# EAGLE design riaa_pre (EAGLE 6.2)
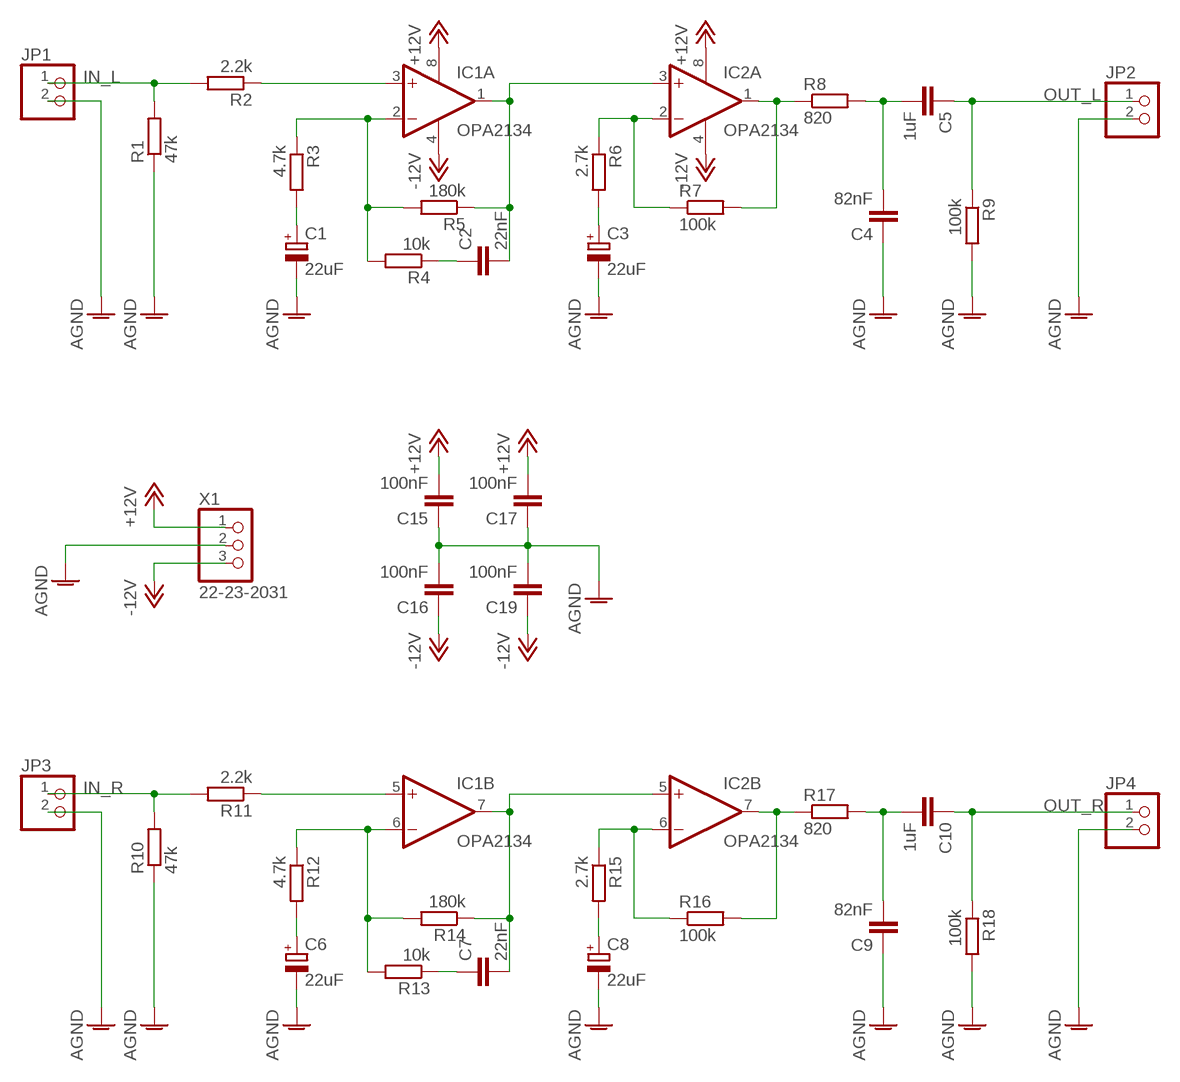
[diagram p0: schematic, sheet 1]

## Parts
C1  22uF  CPOL-EUE2.5-6  [E2,5-6]
C2  22nF  C-EU050-025X075  [C050-025X075]
C3  22uF  CPOL-EUE2.5-6  [E2,5-6]
C4  82nF  C-EU050-025X075  [C050-025X075]
C5  1uF  C-EU050-045X075  [C050-045X075]
C6  22uF  CPOL-EUE2.5-6  [E2,5-6]
C7  22nF  C-EU050-025X075  [C050-025X075]
C8  22uF  CPOL-EUE2.5-6  [E2,5-6]
C9  82nF  C-EU050-025X075  [C050-025X075]
C10  1uF  C-EU050-045X075  [C050-045X075]
C15  100nF  C-EU050-025X075  [C050-025X075]
C16  100nF  C-EU050-025X075  [C050-025X075]
C17  100nF  C-EU050-025X075  [C050-025X075]
C19  100nF  C-EU050-025X075  [C050-025X075]
IC1  OPA2134  OPA2134PA  [DIL08]
IC2  OPA2134  OPA2134PA  [DIL08]
JP1  PINHD-1X2  [1X02]
JP2  PINHD-1X2  [1X02]
JP3  PINHD-1X2  [1X02]
JP4  PINHD-1X2  [1X02]
R1  47k  R-EU_0207/7  [0207/7]
R2  2.2k  R-EU_0207/7  [0207/7]
R3  4.7k  R-EU_0207/7  [0207/7]
R4  10k  R-EU_0207/7  [0207/7]
R5  180k  R-EU_0207/7  [0207/7]
R6  2.7k  R-EU_0207/7  [0207/7]
R7  100k  R-EU_0207/7  [0207/7]
R8  820  R-EU_0207/7  [0207/7]
R9  100k  R-EU_0207/7  [0207/7]
R10  47k  R-EU_0207/7  [0207/7]
R11  2.2k  R-EU_0207/7  [0207/7]
R12  4.7k  R-EU_0207/7  [0207/7]
R13  10k  R-EU_0207/7  [0207/7]
R14  180k  R-EU_0207/7  [0207/7]
R15  2.7k  R-EU_0207/7  [0207/7]
R16  100k  R-EU_0207/7  [0207/7]
R17  820  R-EU_0207/7  [0207/7]
R18  100k  R-EU_0207/7  [0207/7]
X1  22-23-2031  [22-23-2031]

## Nets
+12V: C15.2 C17.2 IC1.8(A:V+) IC2.8(A:V+) X1.1
-12V: C16.1 C19.1 IC1.4(A:V-) IC2.4(A:V-) X1.3
AGND: C1.- C3.- C4.1 C6.- C8.- C9.1 C15.1 C16.2 C17.1 C19.2 JP1.2 JP2.2 JP3.2 JP4.2 R1.1 R9.2 R10.1 R18.2 X1.2
IN_L: JP1.1 R1.2 R2.2
IN_R: JP3.1 R10.2 R11.2
N$1: C3.+ R6.2
N$2: IC1.3(A:+IN) R2.1
N$3: C2.2 IC1.1(A:OUT) IC2.3(A:+IN) R5.1
N$4: C4.2 C5.2 R8.2
N$5: C2.1 R4.1
N$6: IC1.2(A:-IN) R3.1 R4.2 R5.2
N$8: IC2.6(B:-IN) R15.1 R16.1
N$9: IC2.7(B:OUT) R16.2 R17.1
N$10: IC1.5(B:+IN) R11.1
N$11: C7.2 IC1.7(B:OUT) IC2.5(B:+IN) R14.1
N$12: C7.1 R13.1
N$13: IC1.6(B:-IN) R12.1 R13.2 R14.2
N$14: C6.+ R12.2
N$15: C8.+ R15.2
N$16: C9.2 C10.2 R17.2
N$19: IC2.2(A:-IN) R6.1 R7.1
N$20: IC2.1(A:OUT) R7.2 R8.1
N$37: C1.+ R3.2
OUT_L: C5.1 JP2.1 R9.1
OUT_R: C10.1 JP4.1 R18.1

## Library data of the parts
C1 C3 C6 C8 = amp:CPOL-EU: POLARIZED CAPACITOR, European symbol
C2 C4 C5 C7 C9 C10 C15-C17 C19 = amp:C-EU: CAPACITOR, European symbol
IC1 IC2 = amp:OPA2*: Dual Operational Amplifier Low Power, Single-Supply, Rail-To-Rail Operational Amplifier Source: http://focus.ti.com/lit/ds/symlink/opa2345.pdf http://focus.ti.com .. opa241.pdf http://focus.ti.com/lit/ds/symlink/opa2134.pdf
JP1-JP4 = amp:PINHD-1X2: PIN HEADER
R1-R18 = amp:R-EU_: RESISTOR, European symbol
X1 = amp:22-23-2031: .100" (2.54mm) Center Header - 3 Pin

## Board
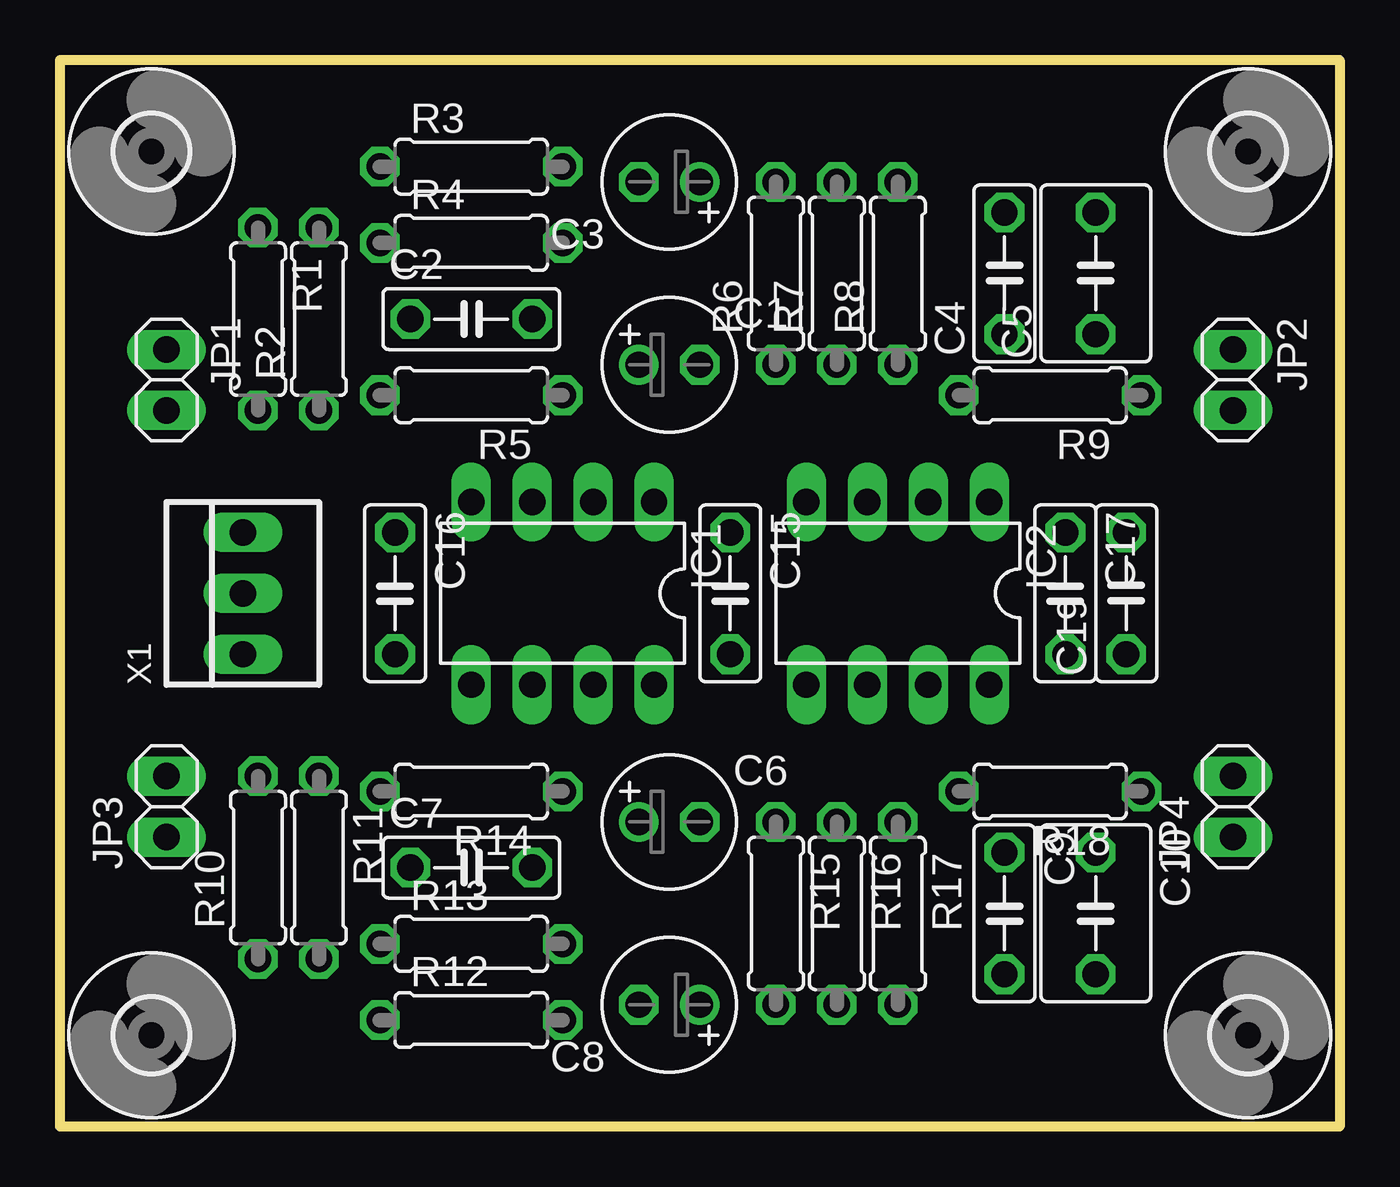
[diagram p1: board, top side]
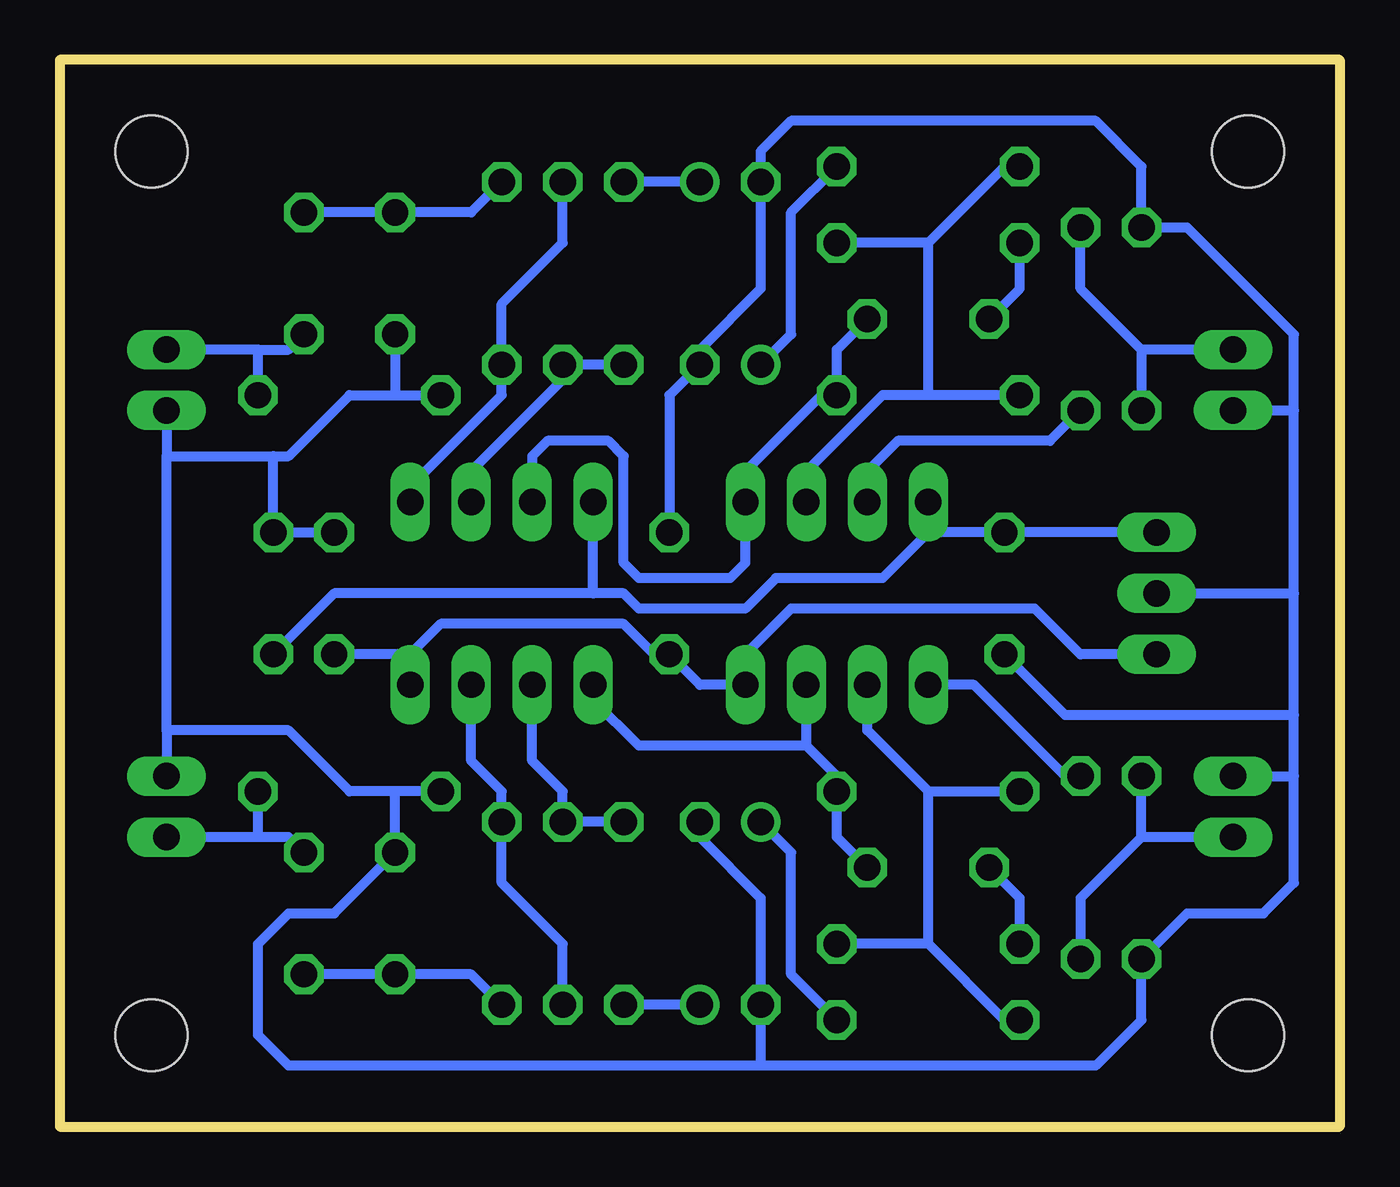
[diagram p2: board, bottom side, seen from below]

Size 53.34 x 44.45 mm. Coordinates in mm from the lower left corner, seen from the top.
Outline: 0.64,44.44 0,44.45
Outline: 0,44.45 0,0 53.34,0 53.34,44.45 0,44.45
Copper layers (1*16): Top 0.035mm / dielectric 1.5mm / Bottom 0.035mm
Design rules: minimum track width 10mil, minimum drill 24mil, track to track 8mil, track to pad 8mil, pad to pad 8mil, via to via 8mil, smd to smd 8mil, copper to edge 40mil, drill to drill 8mil, minimum pad ring 10mil, minimum via ring 8mil, stop-mask expansion 4mil, vias tented up to drill 0mil, thermal gap 10mil

### Footprints (pad centres in the part's own frame; a part is rotated, then mirrored left to right if it is on the bottom)
E2,5-6 = drill 1.1: + -1.27,0 | drill 1.1 pad 1.6 octagon: - 1.27,0
C050-025X075 = drill 1.1 octagon: 1 -2.54,0; 2 2.54,0
C050-045X075 = drill 1.1 octagon: 1 -2.54,0; 2 2.54,0
DIL08 = drill 1.1 long: 1 -3.81,-3.81; 2 -1.27,-3.81; 3 1.27,-3.81; 4 3.81,-3.81; 5 3.81,3.81; 6 1.27,3.81; 7 -1.27,3.81; 8 -3.81,3.81
1X02 = drill 1.1 long: 1 -1.27,0; 2 1.27,0
0207/7 = drill 1.1 octagon: 1 -3.81,0; 2 3.81,0
3,0 = hole 3: 0,0
22-23-2031 = drill 1.1 long: 1 -2.54,0; 2 0,0; 3 2.54,0

### Placement (x,y rotation side)
C1  25.4,31.75 0 top
C2  17.14,33.66 0 top
C3  25.4,39.37 180 top
C4  39.37,35.56 90 top
C5  43.18,35.56 90 top
C6  25.4,12.7 0 top
C7  17.14,10.79 0 top
C8  25.4,5.08 180 top
C9  39.37,8.89 270 top
C10  43.18,8.89 270 top
C15  27.94,22.23 270 top
C16  13.97,22.23 270 top
C17  41.91,22.23 270 top
C19  44.45,22.23 90 top
IC1  20.95,22.23 180 top
IC2  34.92,22.23 180 top
JP1  4.45,31.11 270 top
JP2  48.9,31.11 270 top
JP3  4.45,13.34 90 top
JP4  48.9,13.34 90 top
R1  8.26,33.66 270 top
R2  10.79,33.66 90 top
R3  17.14,40.01 0 top
R4  17.14,36.83 0 top
R5  17.14,30.48 180 top
R6  29.84,35.56 90 top
R7  32.38,35.56 90 top
R8  34.92,35.56 90 top
R9  41.27,30.48 180 top
R10  8.26,10.79 90 top
R11  10.79,10.79 270 top
R12  17.14,4.45 0 top
R13  17.14,7.62 0 top
R14  17.14,13.97 180 top
R15  29.84,8.89 270 top
R16  32.38,8.89 270 top
R17  34.92,8.89 270 top
R18  41.27,13.97 180 top
U$1  [3,0]  3.81,3.81 0 top
U$2  [3,0]  3.81,40.64 0 top
U$3  [3,0]  49.53,40.64 0 top
U$4  [3,0]  49.53,3.81 0 top
X1  7.62,22.23 90 top

### Tracks (layer width: path | path; a pad name or v marks a point on that pad's centre or on a via)
+12V
  Bottom 0.406: 38.73,19.68 37.47,20.95 29.84,20.95 28.57,19.68 C15.2 26.67,18.41 IC1.8 24.77,19.68 22.86,21.59 12.7,21.59 10.79,19.68 X1.1 | 38.73,19.68 IC2.8 | 38.73,19.68 C17.2
-12V
  Bottom 0.406: X1.3 C16.1 17.14,24.77 | 17.14,24.77 IC1.4 | C19.1 41.91,22.23 31.11,22.23 | 17.14,24.77 19.05,22.86 23.5,22.86 24.77,21.59 29.21,21.59 29.84,22.23 31.11,22.23 | 31.11,22.23 IC2.4
AGND
  Bottom 0.406: C17.1 C19.2 44.45,27.94 | C15.1 27.94,30.48 C1.- 26.67,32.38 24.13,34.92 C3.- 24.13,40.64 22.86,41.91 10.16,41.91 8.26,40.01 R1.1 6.35,37.47 1.91,33.02 1.91,29.84 | 1.91,22.23 1.91,29.84 | 1.91,17.14 1.91,22.23 | 1.91,14.61 1.91,10.16 3.17,8.89 6.35,8.89 R10.1 8.26,4.45 10.16,2.54 24.13,2.54 | 1.91,14.61 1.91,17.14 | 1.91,17.14 11.43,17.14 C16.2 | 24.13,2.54 43.81,2.54 45.09,3.81 45.09,7.62 43.81,8.89 41.91,8.89 C9.1 39.37,13.97 | 48.9,16.51 JP4.2 | 48.9,16.51 48.9,27.94 | 48.9,16.51 43.81,16.51 41.27,13.97 39.37,13.97 | 48.9,27.94 44.45,27.94 | 44.45,27.94 43.81,27.94 41.27,30.48 39.37,30.48 | X1.2 1.91,22.23 | JP1.2 1.91,29.84 | JP3.2 1.91,14.61 | JP2.2 48.9,27.94 | R18.2 39.37,13.97 | C6.- 26.67,12.06 24.13,9.53 C8.- 24.13,2.54 | 39.37,30.48 R9.2 | C4.1 39.37,30.48
IN_L
  Bottom 0.406: 8.26,32.38 R1.2 | 8.26,32.38 10.79,34.92 R2.2 | JP1.1 8.26,32.38
IN_R
  Bottom 0.406: 8.26,12.06 R10.2 | 8.26,12.06 10.79,9.53 R11.2 | JP3.1 8.26,12.06
N$1
  Bottom 0.406: C3.+ R6.2
N$2
  Bottom 0.406: R2.1 12.06,28.57 18.41,28.57 19.68,27.3 IC1.3
N$3
  Bottom 0.406: IC2.3 33.66,27.94 33.02,28.57 30.48,28.57 29.84,27.94 29.84,23.5 29.21,22.86 25.4,22.86 24.77,23.5 IC1.1 24.77,27.3 21.59,30.48 R5.1 20.95,32.38 C2.2
N$4
  Bottom 0.406: R8.2 36.2,38.1 C4.2 C5.2
N$5
  Bottom 0.406: R4.1 13.34,34.92 C2.1
N$6
  Bottom 0.406: R5.2 17.14,30.48 | 17.14,30.48 19.05,30.48 22.23,27.3 IC1.2 | R3.1 13.97,40.01 17.14,36.83 | 17.14,30.48 17.14,36.83 | 17.14,36.83 R4.2
N$8
  Bottom 0.406: R15.1 R16.1 32.38,13.97 33.66,15.24 IC2.6
N$9
  Bottom 0.406: IC2.7 36.2,15.24 34.92,13.97 R17.1 34.92,10.16 32.38,7.62 R16.2
N$10
  Bottom 0.406: R11.1 11.43,14.61 15.24,18.41 IC1.5
N$11
  Bottom 0.406: C7.2 20.95,12.06 R14.1 20.95,14.61 22.23,15.88 | 22.23,15.88 IC1.7 | IC2.5 31.11,17.78 29.21,15.88 22.23,15.88
N$12
  Bottom 0.406: R13.1 13.34,9.53 C7.1
N$13
  Bottom 0.406: R12.1 13.97,4.45 17.14,7.62 | 17.14,7.62 R13.2 | 17.14,7.62 17.14,13.97 | 17.14,13.97 19.68,16.51 IC1.6 | 17.14,13.97 R14.2
N$14
  Bottom 0.406: R12.2 22.86,6.35 22.86,11.43 C6.+
N$15
  Bottom 0.406: C8.+ R15.2
N$16
  Bottom 0.406: R17.2 36.2,6.35 C9.2 C10.2
N$19
  Bottom 0.406: IC2.2 36.2,27.3 32.38,31.11 R7.1 R6.1
N$20
  Bottom 0.406: IC2.1 38.73,26.67 34.92,30.48 R8.1 34.92,34.29 32.38,36.83 R7.2
N$37
  Bottom 0.406: R3.2 22.86,38.1 22.86,33.02 C1.+
OUT_L
  Bottom 0.406: C5.1 43.81,32.38 45.09,32.38 | 45.09,32.38 JP2.1 | R9.1 45.09,32.38
OUT_R
  Bottom 0.406: C10.1 43.81,12.06 45.09,12.06 | 45.09,12.06 JP4.1 | 45.09,12.06 R18.1